# EAGLE design puente h (EAGLE 7.5.0)
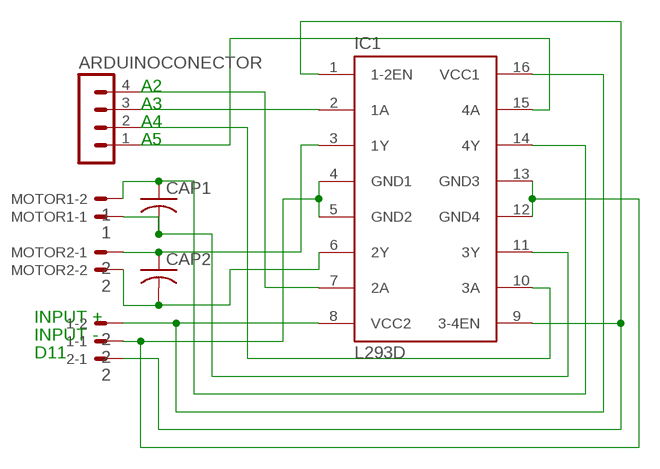
[diagram p0: schematic, sheet 1]

## Parts
1  2  332-02  [332-02]
2  2  332-02  [332-02]
ARDUINOCONECTOR  MA04-1  [MA04-1]
CAP1  C-US025-025X050  [C025-025X050]
CAP2  C-US025-025X050  [C025-025X050]
IC1  L293D  [DIL16]
MOTOR1  1  332-02  [332-02]
MOTOR2  2  332-02  [332-02]

## Nets
N$1: ARDUINOCONECTOR.4 IC1.7(2A)
N$2: ARDUINOCONECTOR.3 IC1.2(1A)
N$3: ARDUINOCONECTOR.2 IC1.10(3A)
N$4: ARDUINOCONECTOR.1 IC1.15(4A)
N$5: CAP1.2 IC1.11(3Y) MOTOR1.1
N$6: CAP1.1 IC1.14(4Y) MOTOR1.2
N$7: 1.2 IC1.8(VCC2) IC1.16(VCC1)
N$8: CAP2.1 IC1.3(1Y) MOTOR2.1
N$9: CAP2.2 IC1.6(2Y) MOTOR2.2
N$12: 2.1 IC1.1(1-2EN) IC1.9(3-4EN)
N$13: 1.1 IC1.4(GND1) IC1.5(GND2) IC1.12(GND4) IC1.13(GND3)
Unconnected: 2.2

## Notes on the sheet
- A2
- A3
- A4
- A5
- INPUT +
- INPUT -
- D11

## Library data of the parts
1 2 MOTOR1 MOTOR2 = con-garry:332-02: 2 Pin - 2mm Dual Row Source: www.mpe-connector.de / garry_shortform_2012.pdf
ARDUINOCONECTOR = con-lstb:MA04-1: PIN HEADER; OC_FARNELL: unknown; OC_NEWARK: unknown
CAP1 CAP2 = rcl:C-US: CAPACITOR, American symbol
IC1 = st-microelectronics:L293D: PUSH-PULL 4 CHANNEL DRIVER; MPN: L293D; OC_FARNELL: 9589619; OC_NEWARK: 56P8249

## Board
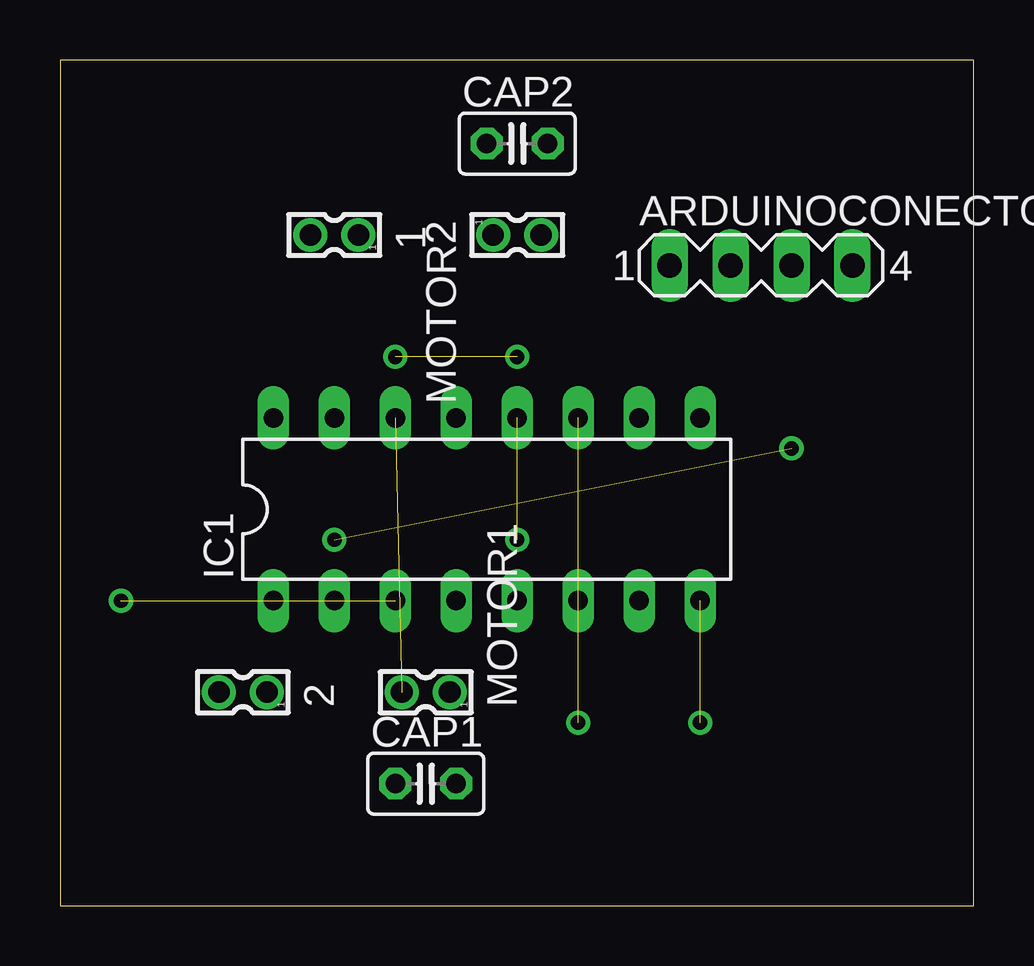
[diagram p1: board, top side]
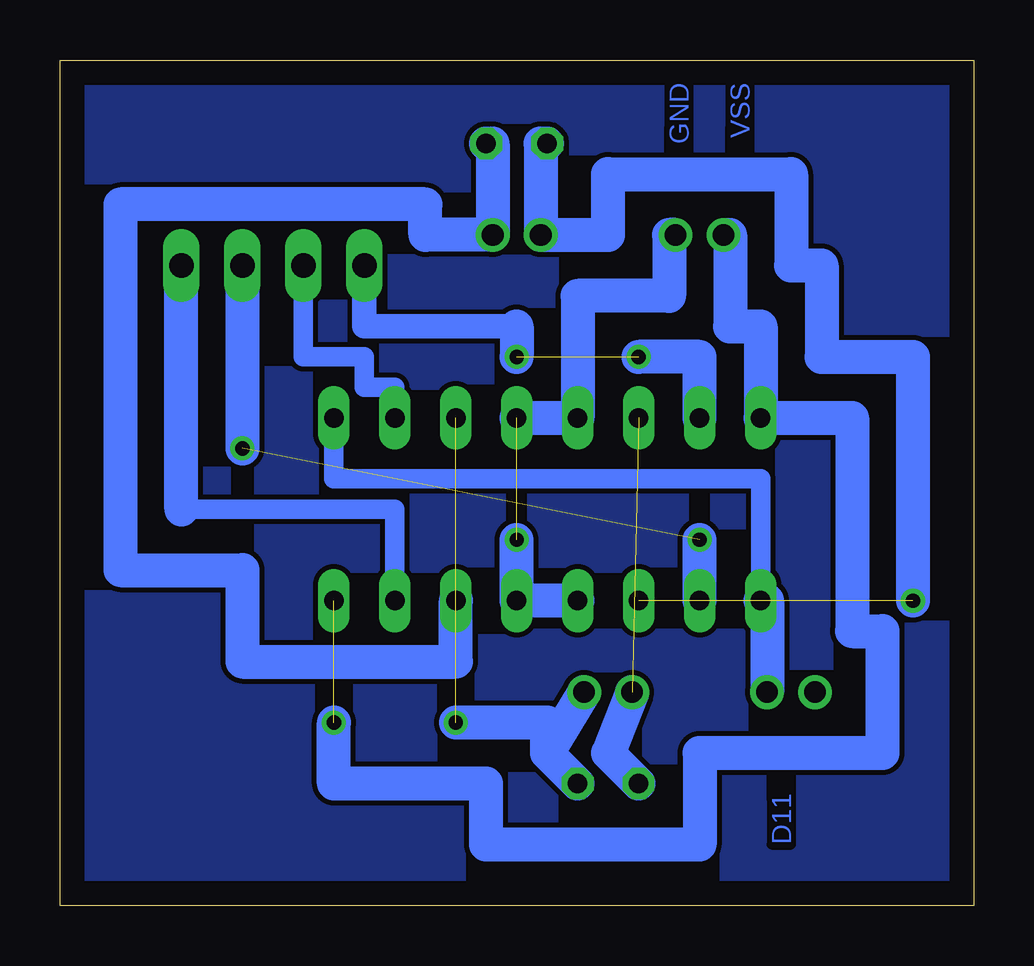
[diagram p2: board, bottom side, seen from below]

Size 38.08 x 35.23 mm. Coordinates in mm from the lower left corner, seen from the top.
Outline: 0,0 38.08,0 38.08,35.23 0,35.23 0,0
Copper layers (1*16): Top 0.035mm / dielectric 1.5mm / Bottom 0.035mm
Design rules "default": minimum track width 10mil, minimum drill 24mil, track to track 8mil, track to pad 8mil, pad to pad 8mil, via to via 8mil, smd to smd 8mil, copper to edge 40mil, drill to drill 8mil, minimum pad ring 10mil, minimum via ring 8mil, stop-mask expansion 4mil, vias tented up to drill 0mil, thermal gap 10mil

### Footprints (pad centres in the part's own frame; a part is rotated, then mirrored left to right if it is on the bottom)
332-02 = drill 0.9 pad 1.27: 1 0,-1; 2 0,1
MA04-1 = drill 1.016 long: 1 -3.81,0; 2 -1.27,0; 3 1.27,0; 4 3.81,0
C025-025X050 = drill 0.813 octagon: 1 -1.27,0; 2 1.27,0
DIL16 = drill 0.813 long: 1 -8.89,-3.81; 2 -6.35,-3.81; 3 -3.81,-3.81; 4 -1.27,-3.81; 5 1.27,-3.81; 6 3.81,-3.81; 7 6.35,-3.81; 8 8.89,-3.81; 9 8.89,3.81; 10 6.35,3.81; 11 3.81,3.81; 12 1.27,3.81; 13 -1.27,3.81; 14 -3.81,3.81; 15 -6.35,3.81; 16 -8.89,3.81

### Placement (x,y rotation side)
1  11.43,27.94 90 top
2  7.62,8.89 90 top
ARDUINOCONECTOR  29.21,26.67 0 top
CAP1  15.24,5.08 0 top
CAP2  19.05,31.75 0 top
IC1  17.78,16.51 0 top
MOTOR1  15.24,8.89 90 top
MOTOR2  19.05,27.94 270 top

### Tracks (layer width: path | path; a pad name or v marks a point on that pad's centre or on a via)
N$1
  Bottom 0.813: IC1.7 24.13,16.51 33.02,16.51
  Bottom 1.422: 33.02,16.51 ARDUINOCONECTOR.4
N$2  (via drill 0.6)  (1 unrouted)
  Bottom 1.422: ARDUINOCONECTOR.3 v30.48,19.05 | IC1.2 v11.43,15.24
N$3
  Bottom 0.813: IC1.10 24.13,21.59 25.4,21.59 25.4,22.86 27.94,22.86 ARDUINOCONECTOR.2
N$4  (via drill 0.6)  (1 unrouted)
  Bottom 1.016: ARDUINOCONECTOR.1 25.4,24.13 19.05,24.13
  Bottom 1.422: IC1.15 11.43,22.86 v13.97,22.86 | 19.05,24.13 v19.05,22.86
N$5  (via drill 0.6)  (1 unrouted)
  Bottom 1.422: 17.78,6.35 CAP1.2 | MOTOR1.1 17.78,6.35 | 17.78,6.35 17.78,7.62 v21.59,7.62
N$6  (1 unrouted)
  Bottom 1.422: MOTOR1.2 15.24,6.35 CAP1.1
N$7  (via drill 0.6)  (1 unrouted)
  Bottom 1.422: 1.2 10.16,27.94 10.16,24.13 8.89,24.13 IC1.16 5.08,20.32 5.08,11.43 3.81,11.43 3.81,6.35 11.43,6.35 11.43,2.54 20.32,2.54 20.32,5.08 26.67,5.08 v26.67,7.62
N$8  (via drill 0.6)  (1 unrouted)
  Bottom 1.422: CAP2.1 18.05,31.75 MOTOR2.1 15.24,27.94 15.24,30.48 7.62,30.48 7.62,26.67 6.35,26.67 6.35,22.86 2.54,22.86 v2.54,12.7
N$9
  Bottom 1.422: CAP2.2 20.05,31.75 MOTOR2.2 22.86,27.94 22.86,29.21 35.56,29.21 35.56,13.97 30.48,13.97 30.48,10.16 21.59,10.16 IC1.6
N$10
  pour Bottom: 0,35.56 0,0 38.1,0 38.1,35.56
N$12
  Bottom 0.813: IC1.1 8.89,17.78 26.67,17.78 IC1.9
  Bottom 1.422: IC1.1 8.62,12.7 2.1
N$13  (via drill 0.6)  (1 unrouted)
  Bottom 1.422: 1.1 12.7,27.94 12.7,25.4 16.51,25.4 IC1.13 IC1.12 | IC1.4 IC1.5 v19.05,15.24

### Text on the board
Bottom: VSS | GND | D11